# EasyEDA Pro project Li_ion_battery_charger-lceda.epro

# Schematic Schematic1
Create Date: 2023-08-24; Page Name: P1; Project Name: 5Vcharge_2023-08-24_11-31-12; Schematic Name: Schematic1; Update Date: 2023-09-03; Company: 嘉立创EDA; Page Size: A4; Version: V1.0
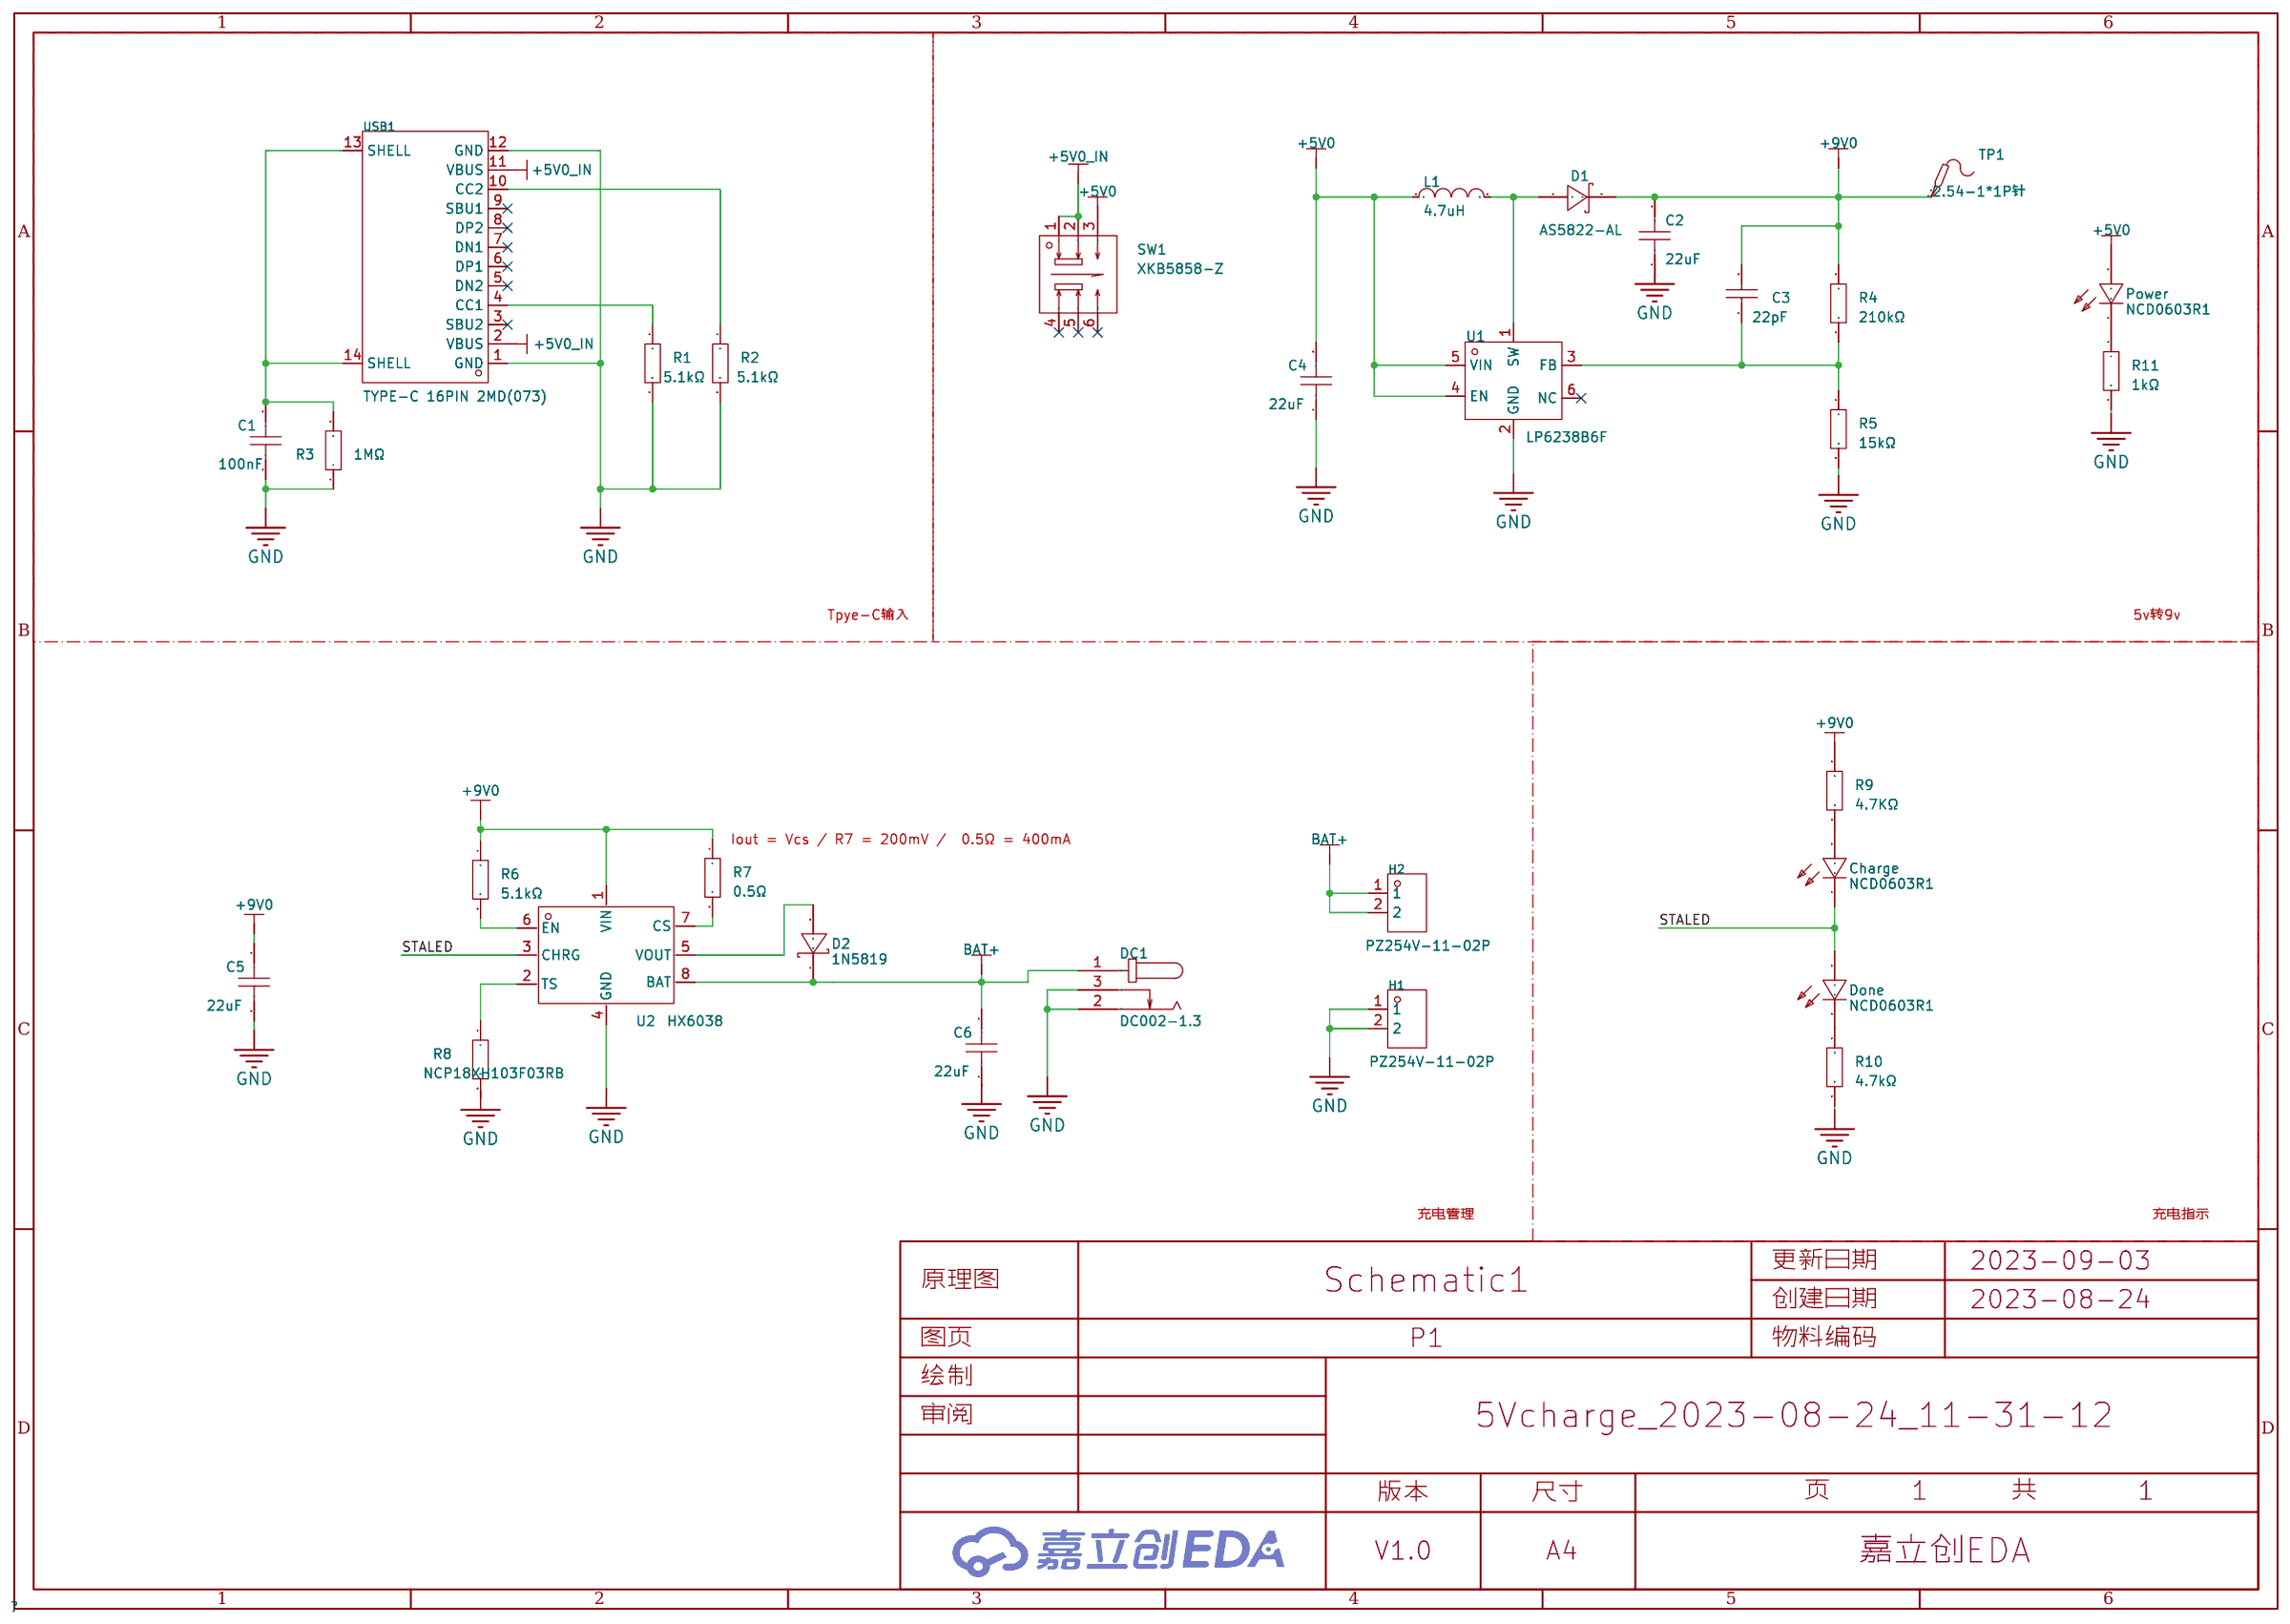
[diagram p0: schematic sheet]

## Parts
C1  100nF  [C0603]
C2  22uF  [C1206]
C3  22pF  [C0603]
C4  22uF  [C1206]
C5  22uF  [C1206]
C6  22uF  [C1206]
Charge  NCD0603R1  [LED0603-RD_RED]
D1  AS5822-AL  [SMA-L_L4.4-W2.6-LS5.0-RD]
D2  1N5819  [SMA_L4.4-W2.6-LS5.0-RD]
DC1  DC002-1.3  [DC-IN-TH_DC002-1.3]
Done  NCD0603R1  [LED0603-RD_RED]
H1  PZ254V-11-02P  [HDR-TH_2P-P2.54-V-M]
H2  PZ254V-11-02P  [HDR-TH_2P-P2.54-V-M]
L1  4.7uH  [IND-SMD_L4.0-W4.0]
Power  NCD0603R1  [LED0603-RD_RED]
R1  5.1kΩ  [R0603]
R2  5.1kΩ  [R0603]
R3  1MΩ  [R0603]
R4  210kΩ  [R0603]
R5  15kΩ  [R0603]
R6  5.1kΩ  [R0603]
R7  0.5Ω  [R0603]
R8  10kΩ  [R0603]
R9  4.7KΩ  [R0603]
R10  4.7kΩ  [R0603]
R11  1kΩ  [R0603]
SW1  XKB5858-Z  [SW-TH_6P-L5.8-W5.8-P2.00-LS4.5-BL]
TP1  2.54-1*1P针  [HDR-TH_1P-P2.54-V-M]
U1  LP6238B6F  [SOT-23-6_L2.9-W1.6-P0.95-LS2.8-BL]
U2  HX6038  [ESOP-8_L4.9-W3.9-P1.27-LS6.0-BL-EP]
USB1  TYPE-C 16PIN 2MD(073)  [USB-C-SMD_TYPE-C-6PIN-2MD-073]

## Library data of the parts
C1 = CC0603KRX7R9BB104: 容值:100nF;精度:±10%;额定电压:50V;材质(温度系数):X7R;; LCSC Part Name: 100nF ±10% 50V; Supplier Part: C14663; Manufacturer: YAGEO(国巨); Supplier Footprint: 0603; JLCPCB Part Class: 基础库; Datasheet: https://atta.szlcsc.com/upload/public/pdf/source/20180910/C282072_33301C7F631E79921B82A8DAC6BCC5B3.pdf; Supplier: LCSC; Tolerance: ±10%; Voltage Rated: 50V; Temperature Coefficient: X7R
C2 C4-C6 = CL31A226KAHNNNE: 容值:22uF;精度:±10%;额定电压:25V;材质(温度系数):X5R;; LCSC Part Name: 22uF ±10% 25V; Supplier Part: C12891; Manufacturer: SAMSUNG(三星); Supplier Footprint: 1206; JLCPCB Part Class: Basic Part; Datasheet: https://atta.szlcsc.com/upload/public/pdf/source/20160103/1457707667836.pdf; Supplier: LCSC; Tolerance: ±10%; Voltage Rated: 25V; Temperature Coefficient: X5R
C3 = CC0603JRNPO9BN220: 容值:22pF;精度:±5%;额定电压:50V;材质(温度系数):NP0;; LCSC Part Name: 22pF ±5% 50V; Supplier Part: C105620; Manufacturer: YAGEO(国巨); Supplier Footprint: 0603; JLCPCB Part Class: 扩展库; Datasheet: https://atta.szlcsc.com/upload/public/pdf/source/20170425/1493115771353.pdf; Supplier: LCSC; Tolerance: ±5%; Voltage Rated: 50V; Temperature Coefficient: NP0
Charge Done Power = NCD0603R1_C84263: 发光颜色:红灯;; LCSC Part Name: 红灯; Supplier Part: C84263; Manufacturer: 国星光电; Supplier Footprint: 0603; JLCPCB Part Class: 扩展库; Datasheet: https://atta.szlcsc.com/upload/public/pdf/source/20200820/C84263_DABC6A75E58F576973B407FDBA283D60.pdf; Supplier: LCSC; Emitted Color: 红灯
D1 = AS5822-AL: 二极管配置:独立式;直流反向耐压(Vr):40V;平均整流电流(Io):3A;正向压降(Vf):500mV@3A;反向电流(Ir):500uA@40V;; LCSC Part Name: 40V 3A 500mV@3A; Supplier Part: C541626; Manufacturer: AnBon(安邦); Supplier Footprint: SMA-L; JLCPCB Part Class: 扩展库; Datasheet: https://atta.szlcsc.com/upload/public/pdf/source/20200522/C541626_33A66A3E2FF9744A21A92C9F131053A6.pdf; Supplier: LCSC; Diode Configuration: 独立式; Reverse Voltage (Vr): 40V; Average Rectified Current (Io): 3A; Forward Voltage (Vf@If): 500mV@3A; Reverse Leakage Current (Ir): 500uA@40V
D2 = 1N5819_C437199: 直流反向耐压(Vr):40V;平均整流电流(Io):1A;正向压降(Vf):500mV@1A;; LCSC Part Name: 40V 1A 500mV@1A; Supplier Part: C437199; Manufacturer: KEXIN(科信); Supplier Footprint: SMA; JLCPCB Part Class: 扩展库; Datasheet: https://atta.szlcsc.com/upload/public/pdf/source/20191012/C437199_83583E622A6684E767605E43C169C596.pdf; Supplier: LCSC; Reverse Voltage (Vr): 40V; Average Rectified Current (Io): 1A; Forward Voltage (Vf@If): 500mV@1A
DC1 = DC002-1.3: 连接器类型:DC电源插座;安装方式:弯插;触点内径:2mm;触点外径:6.3mm;额定电流:500mA;额定电压:30V;工作温度范围:-40℃~+55℃;; LCSC Part Name: DC座 DC-002 内芯1.3 圆针 3脚插件DC; Supplier Part: C668593; Manufacturer: SHOU HAN(首韩); Supplier Footprint: Through Hole; JLCPCB Part Class: Extended Part; Datasheet: https://atta.szlcsc.com/upload/public/pdf/source/20200619/C668593_6B5785499F122503841AA69BD23A954B.pdf; Supplier: LCSC; Connector Type: DC电源插座; Mounting Style: 弯插; Inside Contact Diameter: 2mm; Outside Contact Diameter: 6.3mm; Current Rating (Max): 500mA; Voltage Rating (Max): 30V; Operating Temperature Range: -40℃~+55℃
H1 H2 = PZ254V-11-02P: 排数:单排;总PIN位数:2P;间距:2.54mm;插针结构:1x2P;行距:-;安装类型:直插;圆针/方针:方针;额定电流:-;额定电压:-;配合针长度:6mm;塑高:2.5mm;端接针长度:3mm;触头材质:黄铜;触头镀层:-;工作温度范围:-40℃~+105℃;颜色:黑色;; LCSC Part Name: 2.54mm 1x2P 直插 方针; Supplier Part: C492401; Manufacturer: XFCN(兴飞); Supplier Footprint: 插件,P=2.54mm; JLCPCB Part Class: 扩展库; Datasheet: https://atta.szlcsc.com/upload/public/pdf/source/20200309/C492401_A812433581A9B211A7FFA413ADDFF0E5.pdf; Supplier: LCSC; Number of Rows: 单排; Number of Pins: 2P; Pitch: 2.54mm; Pin Structure: 1x2P; Mounting Type: 直插; Circluar Pins/Square Pins: 方针; Length of Mating Pin: 6mm; Insulation Height: 2.5mm; Length of End Connection Pin: 3mm; Contact Material: 黄铜; Operating Temperature Range: -40℃~+105℃; Color: 黑色
L1 = SWPA4030S4R7MT: 直流电阻(DCR):78mΩ;精度:±20%;电感值:4.7uH;额定电流:2A;; LCSC Part Name: 4.7uH ±20%; Supplier Part: C57269; Manufacturer: Sunlord(顺络); Supplier Footprint: SMD; JLCPCB Part Class: 扩展库; Datasheet: https://atta.szlcsc.com/upload/public/pdf/source/20161024/1477287957557.pdf; Supplier: LCSC; DC Resistance (DCR): 78mΩ; Tolerance: ±20%; Height: 3mm; Width: 4mm; Rated Current: 2A; Length: 4mm
R1 R2 R5-R7 R9-R11 = 0603WAF5101T5E: 电阻类型:厚膜电阻;阻值:5.1kΩ;精度:±1%;功率:100mW;; LCSC Part Name: 5.1kΩ ±1% 100mW; Supplier Part: C23186; Manufacturer: UNI-ROYAL(厚声); Supplier Footprint: 0603; JLCPCB Part Class: Basic Part; Datasheet: https://atta.szlcsc.com/upload/public/pdf/source/20200306/C422600_1E6D84923E4A46A82E41ADD87F860B5C.pdf; Supplier: LCSC; Type: 厚膜电阻; Tolerance: ±1%; Power(Watts): 100mW; Temperature Coefficient: ±100ppm/℃; Overload Voltage (Max): 75V; Operating Temperature Range: -55℃~+155℃
R3 = 0603WAF1002T5E: 电阻类型:厚膜电阻;阻值:10kΩ;精度:±1%;功率:100mW;; LCSC Part Name: 厚膜电阻 10kΩ ±1% 100mW; Supplier Part: C25804; Manufacturer: UNI-ROYAL(厚声); Supplier Footprint: 0603; JLCPCB Part Class: 基础库; Datasheet: https://atta.szlcsc.com/upload/public/pdf/source/20200306/C422600_1E6D84923E4A46A82E41ADD87F860B5C.pdf; Supplier: LCSC; Type: 厚膜电阻; Tolerance: ±1%; Power(Watts): 100mW; Temperature Coefficient: ±100ppm/℃; Overload Voltage (Max): 75V; Operating Temperature Range: -55℃~+155℃
R4 = 0603WAF2103T5E: 电阻类型:厚膜电阻;阻值:210kΩ;精度:±1%;功率:100mW;; LCSC Part Name: 210kΩ ±1% 100mW; Supplier Part: C22952; Manufacturer: UNI-ROYAL(厚声); Supplier Footprint: 0603; JLCPCB Part Class: Extended Part; Datasheet: https://atta.szlcsc.com/upload/public/pdf/source/20200306/C422600_1E6D84923E4A46A82E41ADD87F860B5C.pdf; Supplier: LCSC; Type: 厚膜电阻; Tolerance: ±1%; Power(Watts): 100mW; Temperature Coefficient: ±100ppm/℃; Overload Voltage (Max): 75V; Operating Temperature Range: -55℃~+155℃
R8 = NCP18XH103F03RB: 阻值(25℃):10kΩ;电阻精度:±1%;B值精度:±1%;B值(25℃/50℃):3380K;功率:100mW;最大稳态电流(25℃):310uA;B值(25℃/75℃):-;B值(25℃/85℃):3334K;B值(25℃/100℃):3455K;工作温度:-40℃~+125℃;; LCSC Part Name: 10kΩ 电阻精度:±1% 3380K; Supplier Part: C13564; Manufacturer: muRata(村田); Supplier Footprint: 0603; JLCPCB Part Class: Extended Part; Datasheet: https://atta.szlcsc.com/upload/public/pdf/source/20130819/1457706638081.pdf; Supplier: LCSC; Resistance Tolerance: ±1%; B Constant Tolerance: ±1%; B Constant (25℃/50℃): 3380K; Power: 100mW; Steady State Current (Max): 310uA; B Constant (25℃/85℃): 3334K; B Constant (25℃/100℃): 3455K; Operating Temperature: -40℃~+125℃; Type: 厚膜电阻; Tolerance: ±1%; Power(Watts): 100mW; Temperature Coefficient: ±100ppm/℃; Overload Voltage (Max): 75V; Operating Temperature Range: -55℃~+155℃
SW1 = XKB5858-Z: 触点电流:100mA;额定电压 (AC):250V;额定电压 (DC):30V;绝缘电阻:100MΩ;电路结构:-;安装方式:直插;自锁/无锁:自锁;按键形状:矩形按钮;按键/盖帽颜色:白色;带灯:无;引脚样式:PC引脚;作用力:160gf@±80gf;防护等级:-;工作温度:-15℃~+55℃;机械寿命:10000;; LCSC Part Name: 按键开关   5.8*5.8插件自锁开关; Supplier Part: C318868; Manufacturer: XKB Connectivity(中国星坤); Supplier Footprint: 插件; JLCPCB Part Class: 扩展库; Datasheet: https://atta.szlcsc.com/upload/public/pdf/source/20181029/C318868_9BE55E0EBE6A2C886ABBB20B390835AF.pdf; Supplier: LCSC; Contact Current: 100mA; Voltage Rating (AC): 250V; Voltage Rating (DC): 30V; Insulation Resistance: 100MΩ; Mounting Style: 直插; Self Lock / No Lock: 自锁; Actuator Style: 矩形按钮; Actuator/Cap Color: 白色; With Lamp: 无; Pin Style: PC引脚; Operating Force: 160gf@±80gf; Operating Temperature: -15℃~+55℃; Mechanical Life: 10000
TP1 = 2.54-1*1P针: 排数:单排;总PIN位数:1P;间距:-;插针结构:-;行距:-;安装类型:直插;圆针/方针:-;额定电流:-;额定电压:-;配合针长度:-;塑高:-;触头材质:-;触头镀层:-;颜色:黑色;; LCSC Part Name: 直插; Supplier Part: C81276; Manufacturer: BOOMELE(博穆精密); Supplier Footprint: 插件,P=2.54mm; JLCPCB Part Class: Extended Part; Datasheet: https://atta.szlcsc.com/upload/public/pdf/source/20221018/3E9408392E35E6F57A28985E5F7BF5C9.pdf; Supplier: LCSC; Number of Rows: 单排; Number of Pins: 1P; Mounting Type: 直插; Color: 黑色
U1 = LP6238B6F: 2.6A MOS电流; Supplier Part: C387749; Manufacturer: LOWPOWER(微源半导体); Supplier Footprint: SOT23-6; JLCPCB Part Class: 扩展库; Datasheet: https://atta.szlcsc.com/upload/public/pdf/source/20190410/C387749_B2830DEFAFD91B88E3FC61060F9C6EEA.pdf; Supplier: LCSC
U2 = IP2312U: LCSC Part Name: 降压开关充电 停产; Supplier Part: C2687800; Manufacturer: INJOINIC(英集芯); Supplier Footprint: SOP-8L; JLCPCB Part Class: 扩展库; Datasheet: https://atta.szlcsc.com/upload/public/pdf/source/20200908/C605432_A60BD6D88F2FAE4109BDCDD377258269.pdf; Supplier: LCSC
USB1 = TYPE-C 16PIN 2MD(073): 连接器类型:Type-C;标准:-;公母:母座;触点数量:16;端口数量:1;安装方式:卧贴;额定电流 - 电源:5A;工作温度范围:-25℃~+85℃;; LCSC Part Name: TYPE-C母座 16P 4脚插件带定位柱 不锈钢外壳 2次模顶; Supplier Part: C2765186; Manufacturer: SHOU HAN(首韩); Supplier Footprint: SMD; JLCPCB Part Class: 扩展库; Supplier: LCSC; Connector Type: Type-C; Gender: 母座; Number of Contacts: 16; Number of Ports: 1; Mounting Style: 卧贴; Current Rating - Power (Max): 5A; Operating Temperature Range: -25℃~+85℃

## Nets
+5V0: C4.2 L1.1 Power.2(A) SW1.3 U1.4(EN) U1.5(VIN)
+5V0_IN: SW1.1 SW1.2 USB1.2(VBUS) USB1.11(VBUS)
+9V0: C2.2 C3.2 C5.2 D1.1(A) R4.2 R6.1 R7.1 R9.1 TP1.1 U2.1(VIN)
GND: C1.1 C2.1 C4.1 C5.1 C6.1 DC1.2 DC1.3 H1.1 H1.2 R1.2 R2.2 R3.1 R5.2 R8.2 R10.2 R11.2 U1.2(GND) U2.4(GND) USB1.1(GND) USB1.12(GND)
BAT+: C6.2 D2.1(C) DC1.1 H2.1 H2.2 U2.8(BAT)
STALED: Charge.1(K) Done.2(A) U2.3(CHRG)
$1N581: C1.2 R3.2 USB1.13(SHELL) USB1.14(SHELL)
$1N716: R1.1 USB1.4(CC1)
$1N720: R2.1 USB1.10(CC2)
$1N1750: R8.1 U2.2(TS)
$1N2530: D1.2(K) L1.2 U1.1(SW)
$1N3681: C3.1 R4.1 R5.1 U1.3(FB)
$1N8246: R6.2 U2.6(EN)
$1N8621: R7.2 U2.7(CS)
$1N8720: D2.2(A) U2.5(VOUT)
$1N8960: Charge.2(A) R9.2
$1N8993: Done.1(K) R10.1
$1N10215: Power.1(K) R11.1

Not connected (* = marked no-connect by the designer): SW1 4* 5* 6*; U1 6(NC)*; USB1 3(SBU2)* 5(DN2)* 6(DP1)* 7(DN1)* 8(DP2)* 9(SBU1)*

## Notes on the sheet
- Tpye-C输入
- 5v转9v
- Iout = Vcs / R7 = 200mV /  0.5Ω = 400mA
- 充电管理
- 充电指示

# Board PCB1
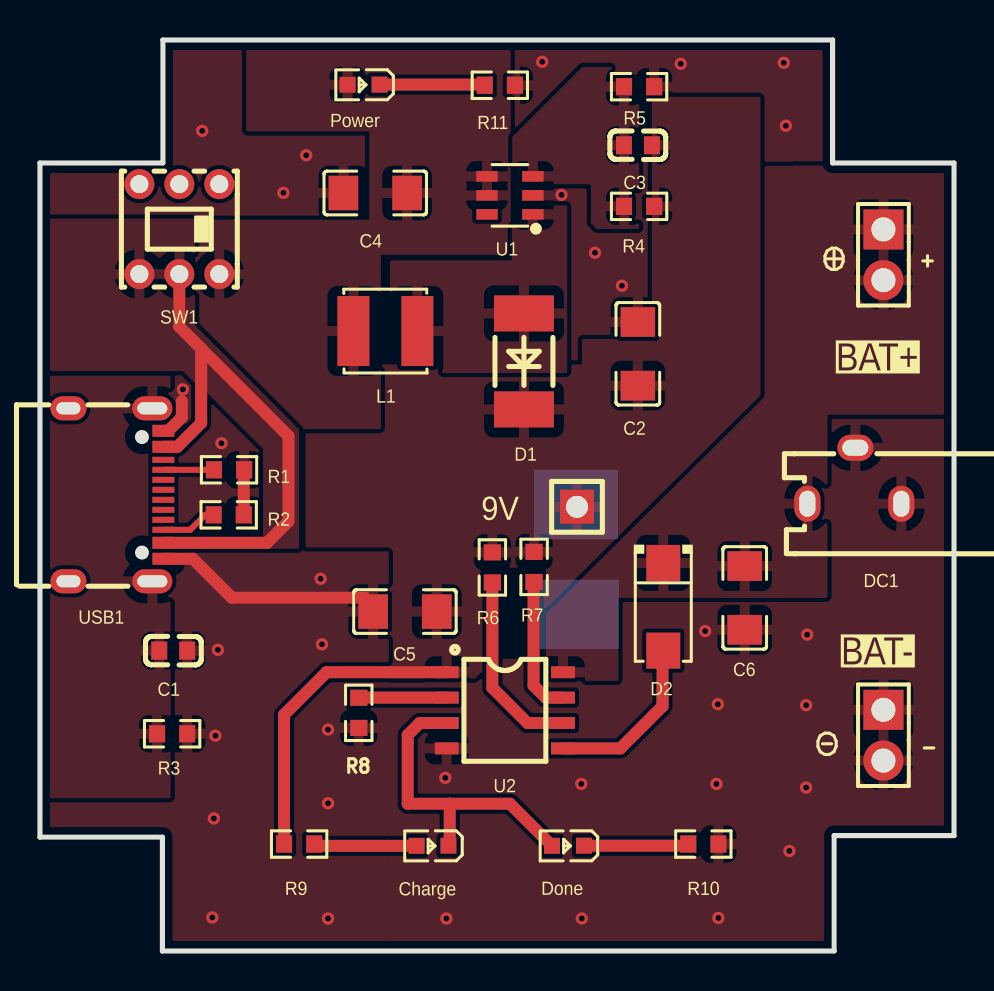
[diagram p1: board, top side]
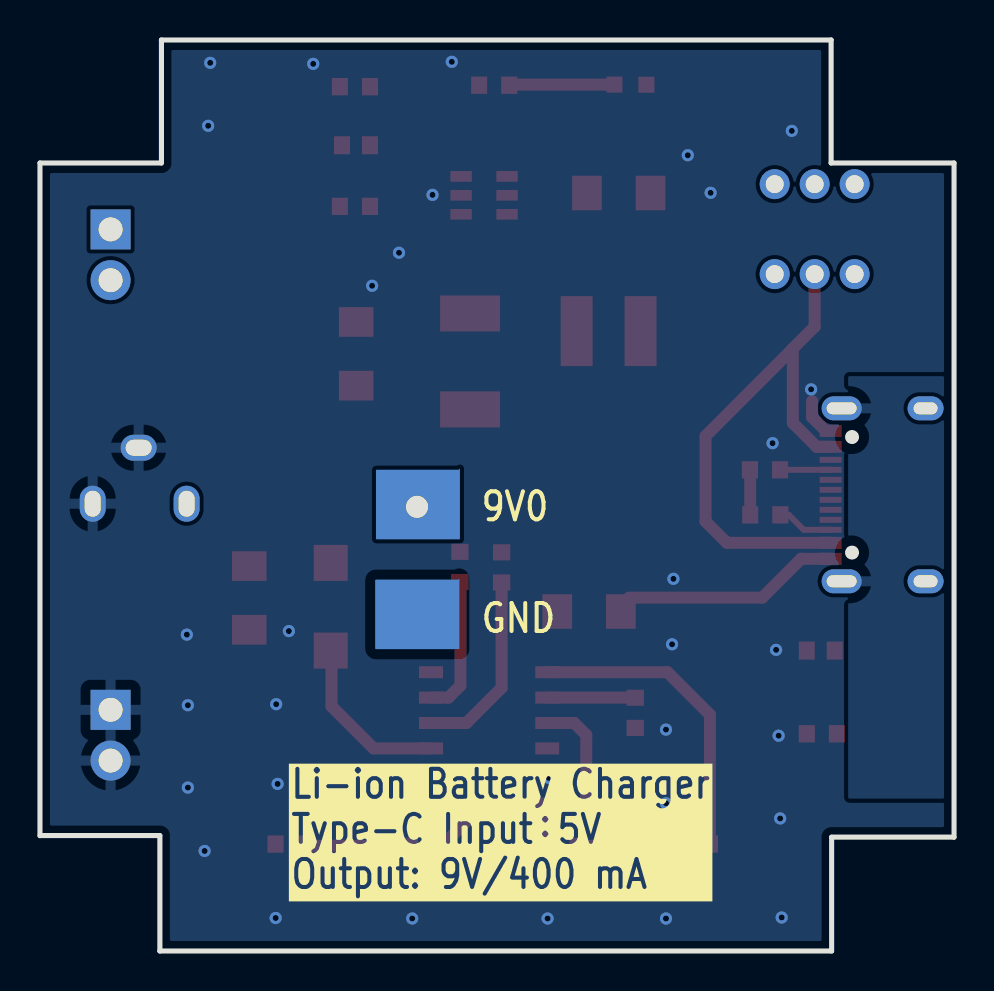
[diagram p2: board, bottom side, seen from below]

Outline 45.75 x 45.57 mm; copper layers: Top Layer, Bottom Layer. Coordinates in mm from the lower left corner of the outline.
Outline path: 0,39.42 6.15,39.42 6.15,45.57 39.67,45.57 39.67,39.42 45.75,39.42 45.75,5.77 39.75,5.77 39.75,0 6.13,0 6.13,5.69 0,5.69 0,39.42
Stack: Top Layer 0.035mm / Dielectric1 1.51mm FR4 er 4.5 / Bottom Layer 0.035mm

## Design rules (mm)
template: JLCPCB Capability(Two Layers Board)
spacing copperThickness1oz (default): track to track 0.102, other pairs 0.152 to 0.3
spacing copperThickness2oz: track to track 0.203, other pairs 0.152 to 0.3
track width copperThickness1oz (default): min 0.127, default 0.254, max 2.54
track width copperThickness2oz: min 0.203, default 0.254, max 2.54
differential pair differentialPair (default): width min 0.127, default 0.254, max 2.54; gap min 0.152, default 0.152
via viaSize (default): diameter min 0.5, default 0.61, max 10; hole min 0.3, default 0.305, max 6.3

## Placement (name value [footprint] x y rotation side)
9V  2.54-1*1P针  [HDR-TH_1P-P2.54-V-M]  26.88 22.22 0 top
+  PZ254V-11-02P  [HDR-TH_2P-P2.54-V-M]  42.21 34.82 270 top
-  PZ254V-11-02P  [HDR-TH_2P-P2.54-V-M]  42.21 10.79 270 top
C1  100nF  [C0603]  6.67 15.03 180 top
C2  22uF  [C1206]  29.92 29.87 270 top
C3  22pF  [C0603]  29.93 40.3 0 top
C4  22uF  [C1206]  16.78 37.91 0 top
C5  22uF  [C1206]  18.27 16.98 0 top
C6  22uF  [C1206]  35.27 17.66 90 top
Charge  NCD0603R1  [LED0603-RD_RED]  19.65 5.26 180 top
D1  AS5822-AL  [SMA-L_L4.4-W2.6-LS5.0-RD]  24.22 29.49 90 top
D2  1N5819  [SMA_L4.4-W2.6-LS5.0-RD]  31.19 17.22 270 top
DC1  DC002-1.3  [DC-IN-TH_DC002-1.3]  40.76 23.77 90 top
Done  NCD0603R1  [LED0603-RD_RED]  26.43 5.26 180 top
L1  4.7uH  [IND-SMD_L4.0-W4.0]  17.29 31.01 0 top
NOREF  -  [Pad_e7587]  26.86 16.84 0 top
NOREF#2  -  [Pad_e7375]  26.83 22.33 0 top
Power  NCD0603R1  [LED0603-RD_RED]  16.2 43.33 180 top
R1  5.1kΩ  [R0603]  9.46 24.07 0 top
R2  5.1kΩ  [R0603]  9.45 21.82 0 top
R3  1MΩ  [R0603]  6.62 10.87 180 top
R4  210kΩ  [R0603]  29.98 37.25 0 top
R5  15kΩ  [R0603]  29.98 43.23 0 top
R6  5.1kΩ  [R0603]  22.64 19.19 270 top
R7  0.5Ω  [R0603]  24.73 19.21 270 top
R8  10kΩ  [R0603]  15.96 11.91 270 top
R9  4.7KΩ  [R0603]  12.97 5.35 0 top
R10  4.7kΩ  [R0603]  33.2 5.35 0 top
R11  1kΩ  [R0603]  23.01 43.3 0 top
SW1  XKB5858-Z  [SW-TH_6P-L5.8-W5.8-P2.00-LS4.5-BL]  6.98 36.11 0 top
U1  LP6238B6F  [SOT-23-6_L2.9-W1.6-P0.95-LS2.8-BL]  23.52 37.8 90 top
U2  HX6038  [ESOP-8_L4.9-W3.9-P1.27-LS6.0-BL-EP]  23.27 12.04 270 top
USB1  TYPE-C 16PIN 2MD(073)  [USB-C-SMD_TYPE-C-6PIN-2MD-073]  3.8 22.82 270 top

## Footprints (pads in the part's own frame, mm; a bottom-side part is the same pattern mirrored in y, then rotated)
C0603
  rect 0.8x0.9 smd: 1(-0.7,0) 2(0.7,0)
C1206
  rect 1.485x1.728 smd: 1(-1.593,0) 2(1.593,0)
DC-IN-TH_DC002-1.3
  oval 1.8x1.3 hole 1.3x0.8: 1(-1.4,2.35) 3(-1.4,-2.35)
  oval 1.3x1.8 hole 0.8x1.3: 2(1.4,-0.05)
ESOP-8_L4.9-W3.9-P1.27-LS6.0-BL-EP
  rect 0.6x1.2 smd: 1(-1.905,-2.909) 2(-0.635,-2.909) 3(0.635,-2.909) 4(1.905,-2.909) 5(1.905,2.909) 6(0.635,2.909) 7(-0.635,2.909) 8(-1.905,2.909)
HDR-TH_1P-P2.54-V-M
  rect 1.7x1.7 hole 1.1: 1(0,0)
HDR-TH_2P-P2.54-V-M
  rect 2x2 hole 1.2: 1(-1.27,0)
  round 2 hole 1.2: 2(1.27,0)
IND-SMD_L4.0-W4.0
  rect 1.6x3.5 smd: 1(-1.6,0) 2(1.6,0)
LED0603-RD_RED
  rect 0.8x0.8 smd: 1(-0.799,-0.004) 2(0.799,0.004)
Pad_e7375
  custom 4.2x3.534 smd far side: 7(0,0)
Pad_e7587
  custom 4.2x3.534 smd far side: 7(0,0)
R0603
  rect 0.806x0.864 smd: 1(-0.753,0) 2(0.753,0)
SMA-L_L4.4-W2.6-LS5.0-RD
  rect 1.8x3 smd: 1(-2.4,0) 2(2.4,0)
SMA_L4.4-W2.6-LS5.0-RD
  rect 1.8x1.7 smd: 1(-2.192,0) 2(2.192,0)
SOT-23-6_L2.9-W1.6-P0.95-LS2.8-BL
  rect 0.532x1.072 smd: 1(-0.95,-1.149) 2(0,-1.149) 3(0.95,-1.149) 4(0.95,1.149) 5(0,1.149) 6(-0.95,1.149)
SW-TH_6P-L5.8-W5.8-P2.00-LS4.5-BL
  round 1.5 hole 0.9: 1(-2,-2.25) 2(0,-2.25) 3(2,-2.25) 4(-2,2.25) 5(0,2.25) 6(2,2.25)
USB-C-SMD_TYPE-C-6PIN-2MD-073
  rect 0.6x1.1 smd: 1(-3.2,2.375) 2(-2.4,2.375) 11(2.4,2.375) 12(3.2,2.375)
  rect 0.3x1.1 smd: 3(-1.75,2.375) 4(-1.25,2.375) 5(-0.75,2.375) 6(-0.25,2.375) 7(0.25,2.375) 8(0.75,2.375) 9(1.25,2.375) 10(1.75,2.375)
  oval 1.2x2 hole 0.6x1.5: 13(-4.325,1.825) 14(4.325,1.825)
  oval 1.2x1.8 hole 0.6x1.2: 13(-4.325,-2.375) 14(4.325,-2.375)

## Nets
As in the schematic, except:
+9V0: 9V.1 C2.2 C3.2 C5.2 D1.1 NOREF#2.7 R4.2 R6.1 R7.1 R9.1 U2.1
GND: -.1 -.2 C1.1 C2.1 C4.1 C5.1 C6.1 DC1.2 DC1.3 NOREF.7 R1.2 R2.2 R3.1 R5.2 R8.2 R10.2 R11.2 U1.2 U2.4 USB1.1 USB1.12
BAT+: +.1 +.2 C6.2 D2.1 DC1.1 U2.8

Pads without a net: SW1 4 5 6; U1 6; USB1 3 5 6 7 8 9

## Via types
v1: diameter 0.61, hole 0.305, Top Layer to Bottom Layer, 33 vias

## Routing (per net, layer and track width the routed paths; a pad name or vN(x,y) marks a point on that pad's centre or on a via; arc(x,y) is an arc through that point)
+5V0_IN: length 27.4
  Top Layer w0.6: USB1.2 6.88,25.22 8.07,26.41 8.07,30.12 ; 8.07,30.12 8.07,30.13 6.98,31.23 SW1.2 ; 8.07,30.12 12.44,25.76 12.44,21.49 11.37,20.42 USB1.11
+9V0: length 15.5
  Top Layer w0.6: U2.1 14.34,13.94 12.22,11.82 R9.1
GND: length 15.2
  Top Layer w0.6: 7.1,27.51 7.1,26.7 6.43,26.02 USB1.1 ; 16.27,17.68 9.6,17.68 7.65,19.62 USB1.12 ; R2.2 10.2,24.05 R1.2
  vias: v1(7.15,28.09) v1(8.12,41.02) v1(8.63,1.68) v1(8.7,6.63) v1(8.78,10.77) v1(8.91,15.06) v1(9.08,25.4) v1(12.18,37.92) v1(13.33,39.8) v1(14.04,18.62) v1(14.11,15.34) v1(14.42,11.08) v1(14.42,7.39) v1(14.42,1.63) v1(20.28,8.66) v1(20.34,1.63) v1(25.14,44.48) v1(26.1,37.82) v1(27.09,8.36) v1(27.12,1.63) v1(27.78,34.93) v1(29.12,33.27) v1(32.07,44.37) v1(33.29,16) v1(33.93,12.34) v1(33.85,8.36) v1(33.95,1.65) v1(37.23,44.42) v1(37.33,41.28) v1(37.51,5) v1(38.4,15.83) v1(38.34,12.29) v1(38.34,8.18)
STALED: length 15.9
  Top Layer w0.6: 20.51,7.37 20.51,5.33 Charge.1 ; 20.51,7.37 23.52,7.37 Done.2 ; 20.51,7.37 18.41,7.37 18.41,10.81 19.01,11.41 U2.3
$1N716: length 2.5
  Top Layer w0.3: 8.65,24.07 USB1.4
$1N720: length 2.8
  Top Layer w0.3: USB1.10 7.52,21.07 8.27,21.82 R2.1
$1N1750: length 4.5
  Top Layer w0.6: U2.2 15.86,12.67
$1N8246: length 9.6
  Top Layer w0.6: U2.6 24.4,11.41 22.64,13.16 22.64,18.46
$1N8621: length 6.9
  Top Layer w0.6: U2.7 25.3,12.67 24.7,13.28 24.7,18.43 R7.2
$1N8720: length 8.7
  Top Layer w0.6: U2.5 29.05,10.14 31.16,12.24 31.16,14.99 D2.2
$1N8960: length 5.2
  Top Layer w0.6: Charge.2 13.81,5.26 R9.2
$1N8993: length 5.3
  Top Layer w0.6: R10.1 32.37,5.27 27.23,5.27
$1N10215: length 5.3
  Top Layer w0.6: Power.1 22.23,43.34 22.26,43.3

## Copper pours and planes (outline as drawn; the poured copper is in the pictures)
+5V0 on Top Layer: 7.76,36.58 16.47,36.58 16.47,40.97 16.5,41 10.32,41 10.32,45.58 10.33,45.59 23.51,45.59 23.56,45.54 23.56,34.82 17.06,34.82 17.06,26.1 13.04,26.1 13,26.06 7.76,31.29
+5V0_IN on Top Layer: 0,36.63 7.72,36.63 7.76,36.68 7.76,31.3 12.97,26.09 12.97,20.12 11.19,20.12 11.17,20.14 11.17,25.12 8.2,28.09 8.07,28.09 7.15,29.01 0,29.01
+9V0 on Top Layer: 30.62,42.72 36.01,42.72 36.06,42.77 36.06,27.8 21.77,13.62 13.29,13.62 13.29,29.34 27.12,29.34 27.12,30.61 30.62,30.61
GND on Top Layer: 0.02,45.69 45.77,45.69 45.77,0 0.02,0
GND on Top Layer: 0,19.98 17.46,19.98 17.46,0 0,0
GND on Bottom Layer: -0.01,45.69 45.86,45.69 45.86,-0.1 -0.01,-0.1
BAT+ on Top Layer: 36.14,39.27 45.75,39.27 45.75,26.86 45.71,26.82 39.41,26.82 39.41,17.66 28.95,17.66 28.95,13.51 25.32,13.51 25.32,16.92 36.14,27.74
$1N581 on Top Layer: 0,28.77 6.54,28.77 6.54,7.65 0,7.65
$1N581 on Bottom Layer: 0,28.75 5.3,28.75 5.3,7.62 0,7.62
$1N2530 on Top Layer: 26.39,28.91 26.39,37.3 23.62,37.29 23.62,34.58 23.59,34.54 17.52,34.54 17.52,28.91
$1N3681 on Top Layer: 29.98,44.22 29.98,36.14 29.96,36.12 27.85,36.12 27.57,36.4 27.57,38.28 27.5,38.35 23.66,38.35 23.64,38.33 23.64,40.72 27.14,44.22
$1N8720 on Top Layer: 29.18,17.66 33.23,17.66 33.23,9.5 25.39,9.5 25.32,9.57 25.32,10.69 29.18,10.69

Small or netless copper shapes (teardrops, artwork), in the pictures only: 5 on Top Layer

## Text on the board
Bottom Silkscreen Layer: 9V0 | GND | Li-ion Battery Charger / Type-C Input：5V / Output: 9V/400 mA
Top Silkscreen Layer: ⊝ | ⊕ | BAT+ | BAT-
